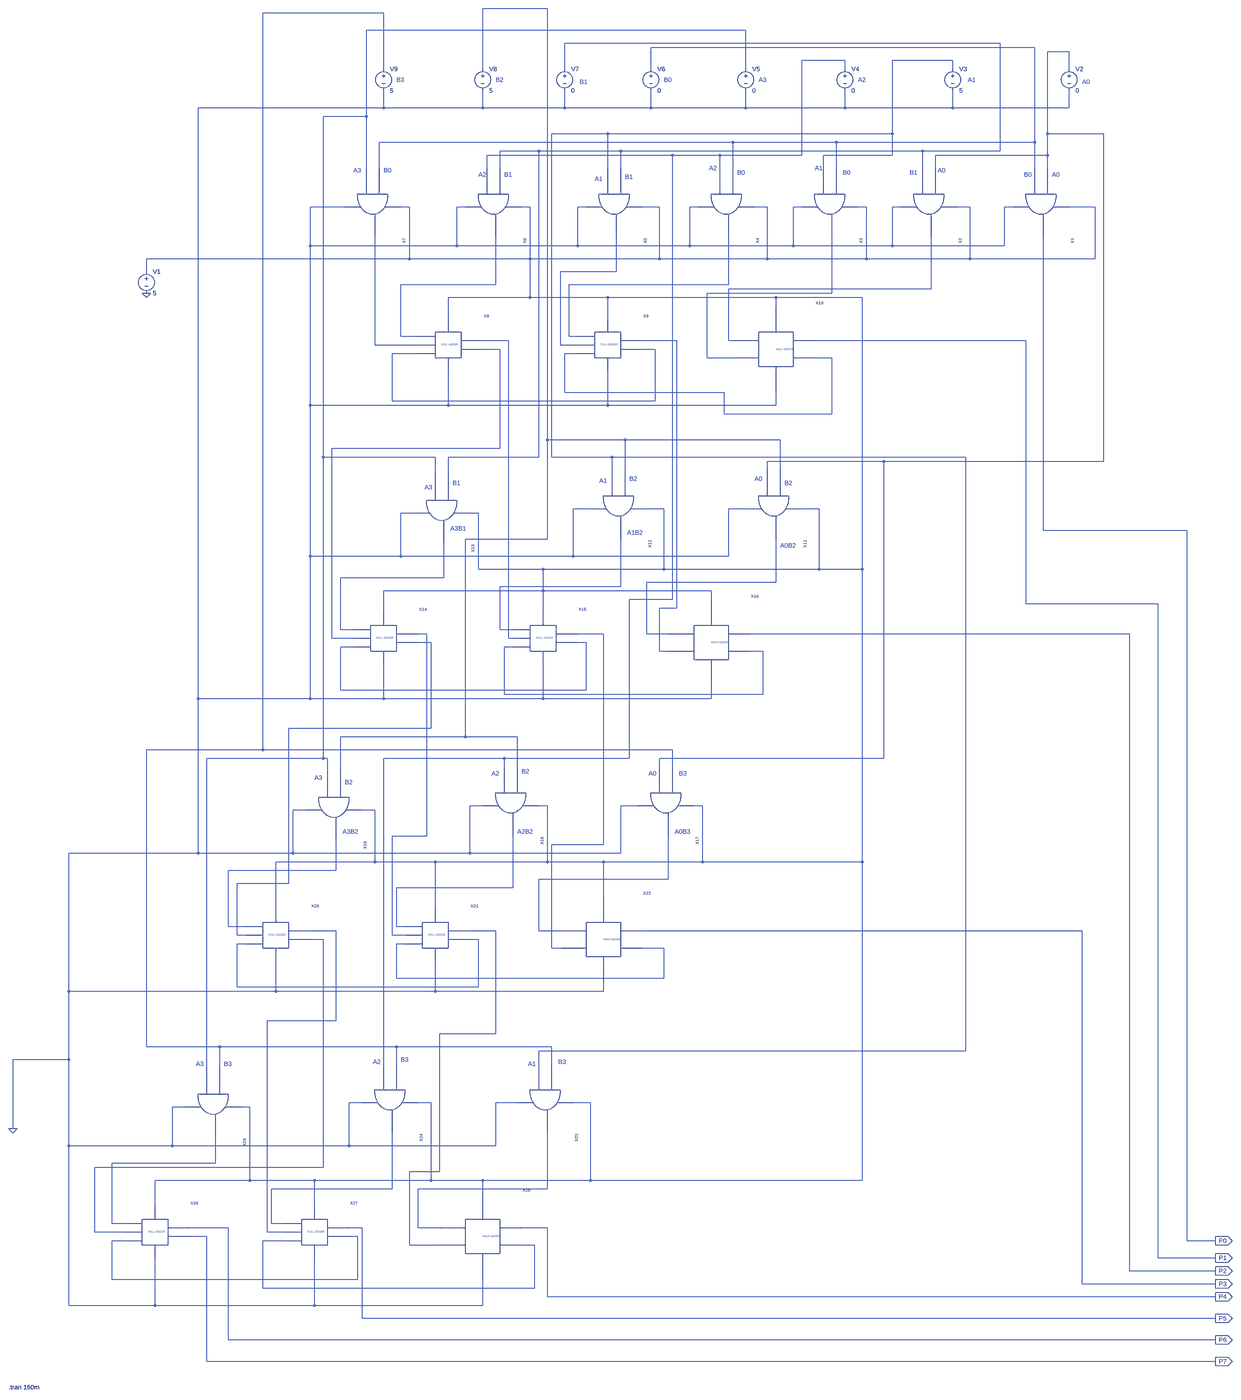
[diagram p0: schematic 4bitmultiplier.asc, whole sheet]
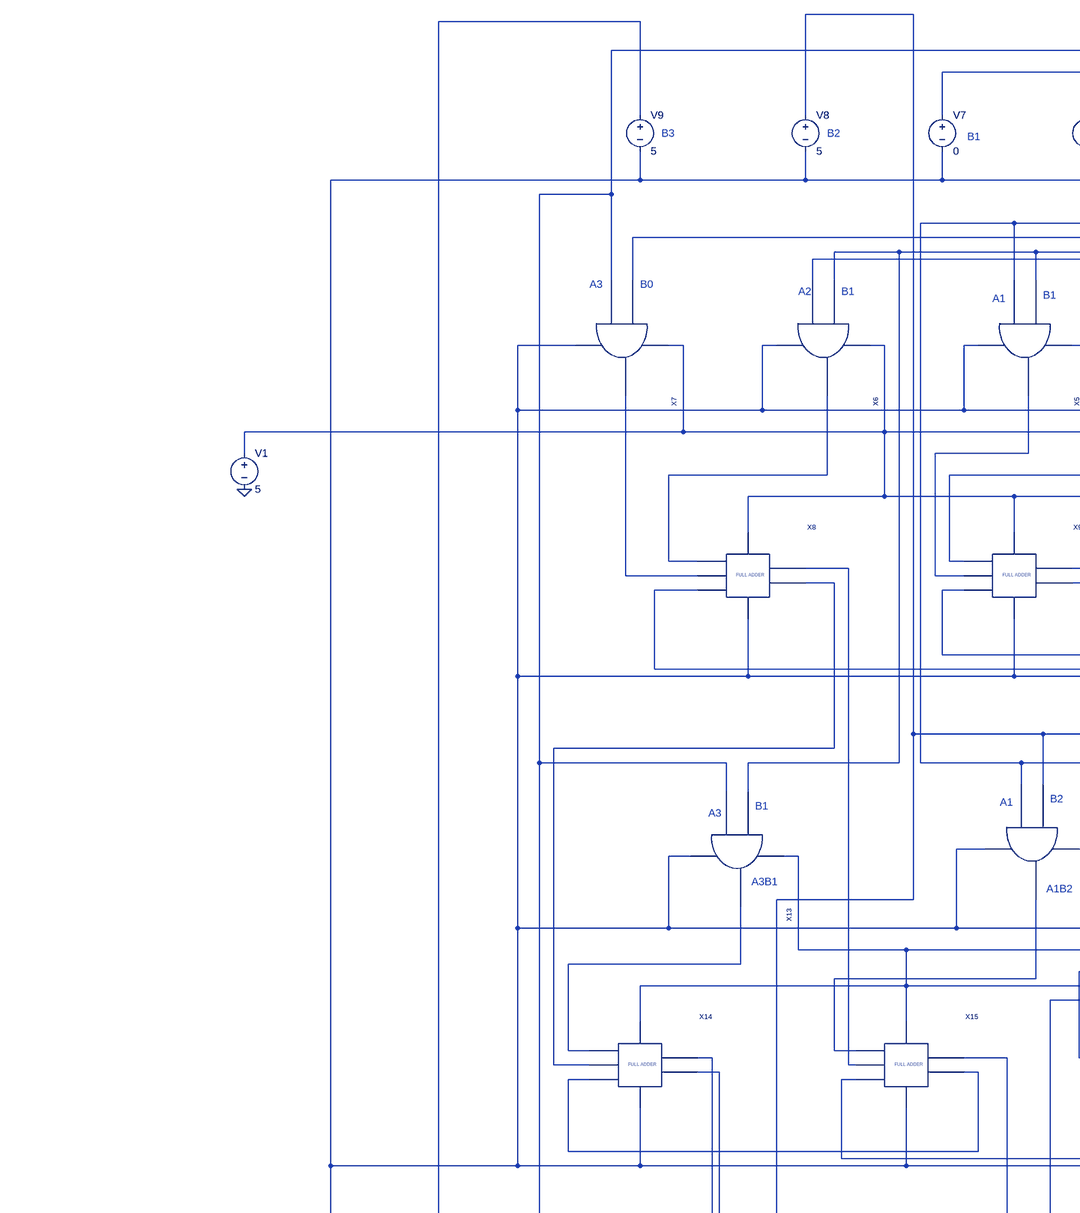
[diagram p1: schematic 4bitmultiplier.asc, part, row 1 of 2, column 1 of 2]
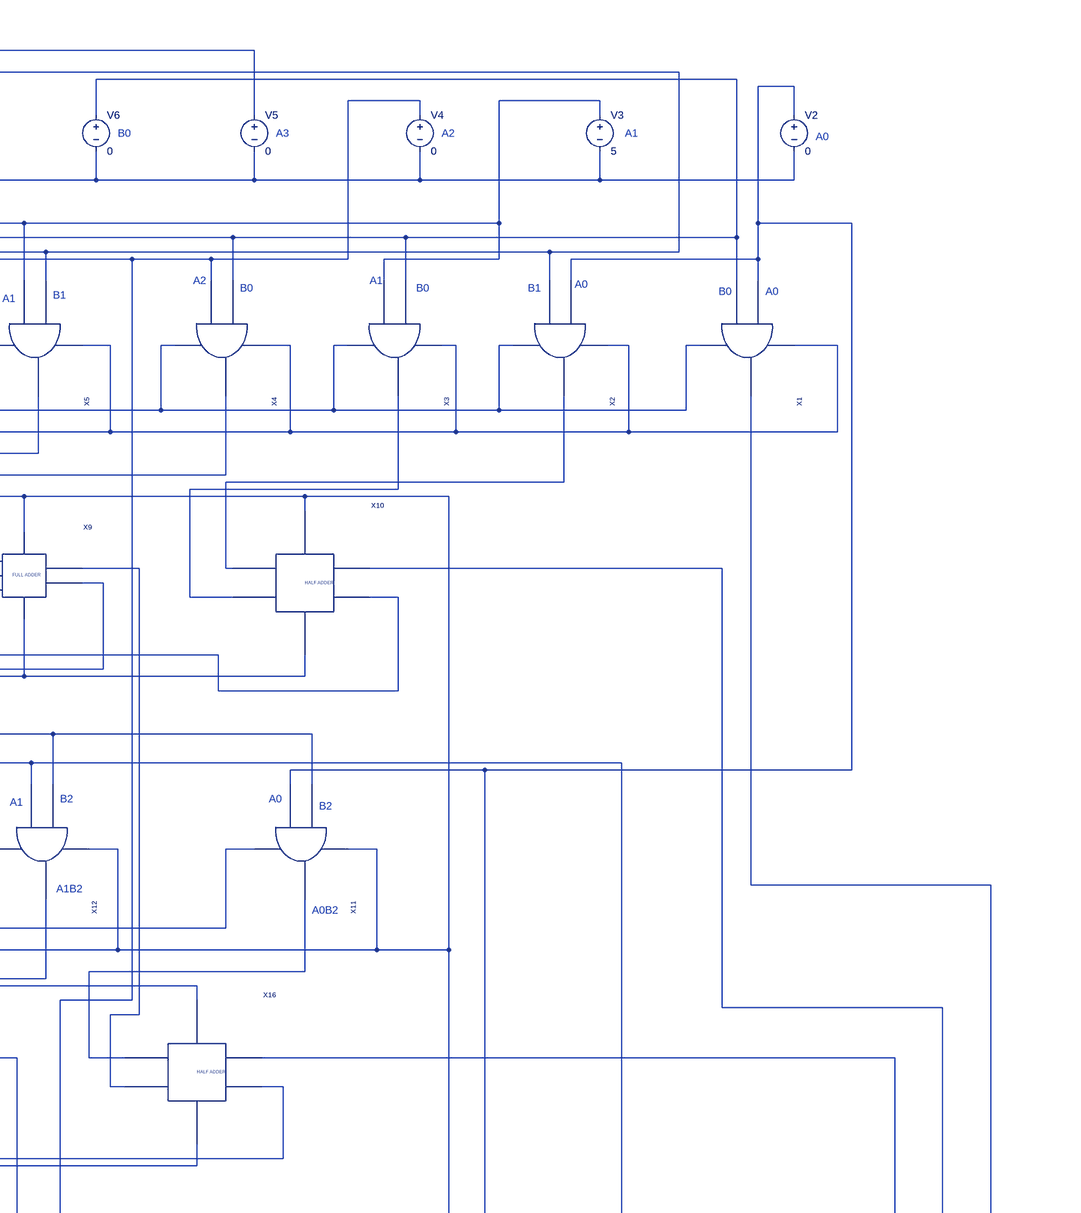
[diagram p2: schematic 4bitmultiplier.asc, part, row 1 of 2, column 2 of 2]
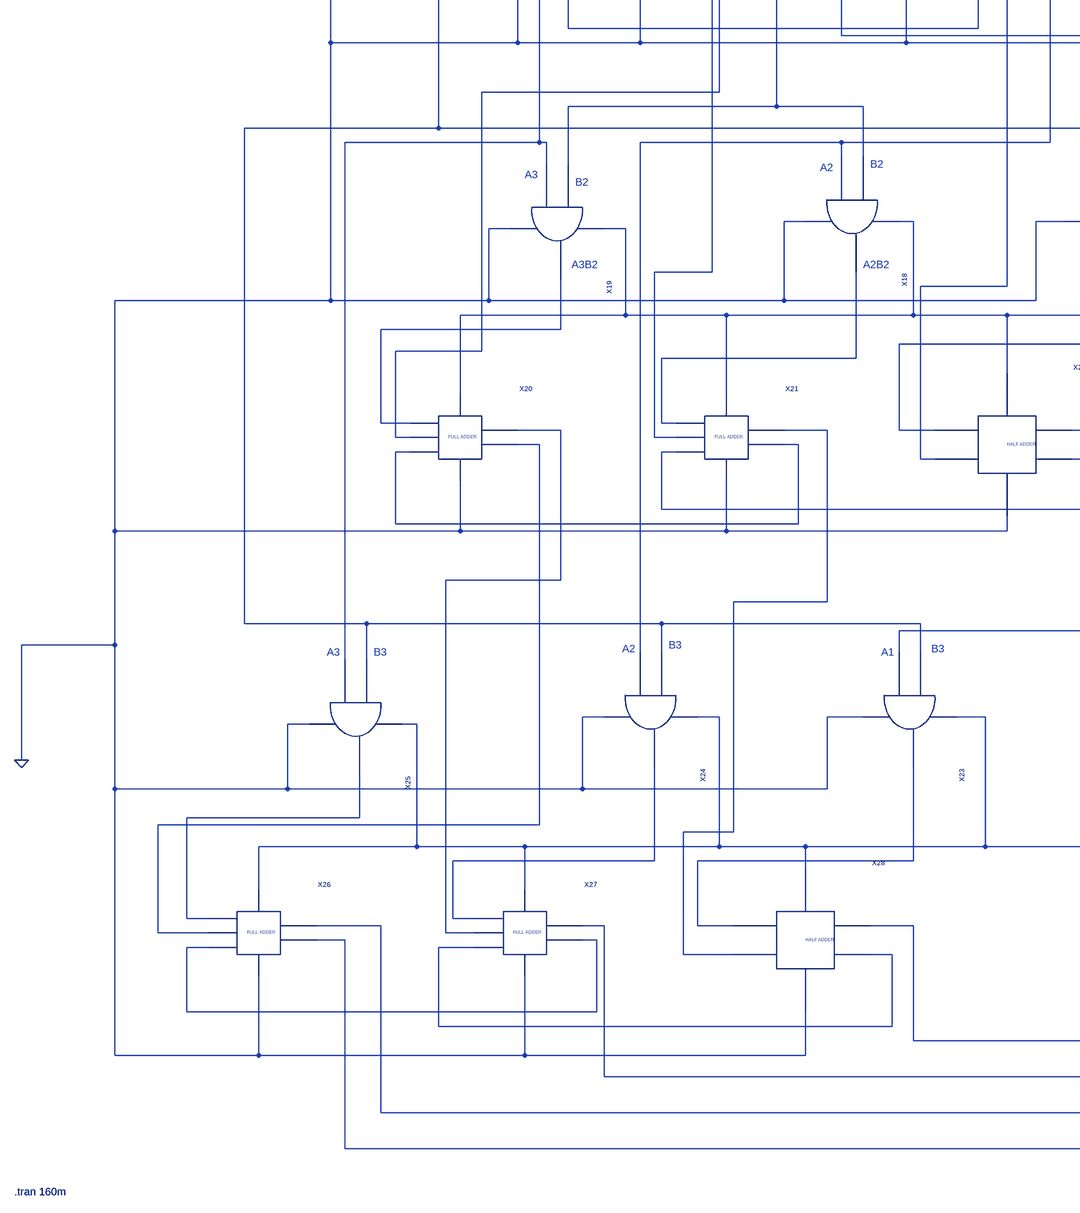
[diagram p3: schematic 4bitmultiplier.asc, part, row 2 of 2, column 1 of 2]
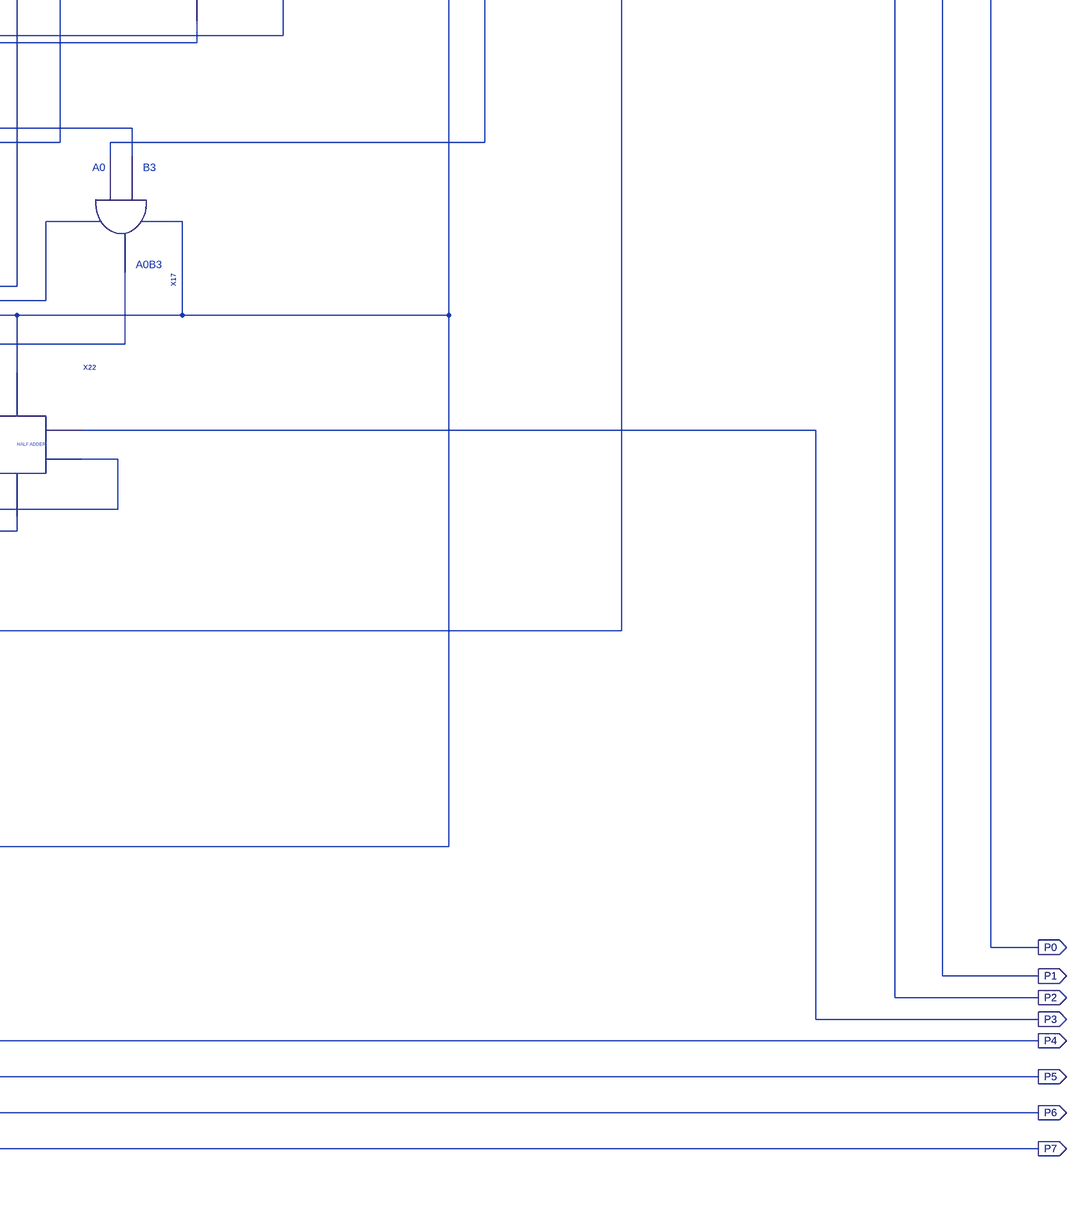
[diagram p4: schematic 4bitmultiplier.asc, part, row 2 of 2, column 2 of 2]
4bitmultiplier.asc, the LTspice schematic file:
Version 4
SHEET 1 1992 4504
WIRE -1168 -880 -1408 -880
WIRE -1776 -864 -2224 -864
WIRE -432 -800 -1840 -800
WIRE 512 -752 -1104 -752
WIRE 640 -736 -784 -736
WIRE 768 -720 688 -720
WIRE -64 -688 -224 -688
WIRE 336 -688 112 -688
WIRE -1776 -656 -1776 -864
WIRE -1408 -656 -1408 -880
WIRE -1104 -656 -1104 -752
WIRE -784 -656 -784 -736
WIRE -432 -656 -432 -800
WIRE -64 -656 -64 -688
WIRE 336 -656 336 -688
WIRE 768 -656 768 -720
WIRE -1776 -512 -1776 -576
WIRE -1776 -512 -2464 -512
WIRE -1408 -512 -1408 -576
WIRE -1408 -512 -1776 -512
WIRE -1104 -512 -1104 -576
WIRE -1104 -512 -1408 -512
WIRE -784 -512 -784 -576
WIRE -784 -512 -1104 -512
WIRE -432 -512 -432 -576
WIRE -432 -512 -784 -512
WIRE -64 -512 -64 -576
WIRE -64 -512 -432 -512
WIRE 336 -512 336 -576
WIRE 336 -512 -64 -512
WIRE 768 -512 768 -576
WIRE 768 -512 336 -512
WIRE -1840 -480 -1840 -800
WIRE -1840 -480 -2000 -480
WIRE -944 -416 -1152 -416
WIRE 112 -416 112 -688
WIRE 112 -416 -944 -416
WIRE 688 -416 688 -720
WIRE 896 -416 688 -416
WIRE -480 -384 -1792 -384
WIRE -96 -384 -480 -384
WIRE 640 -384 640 -736
WIRE 640 -384 -96 -384
WIRE -1200 -352 -1344 -352
WIRE -896 -352 -1200 -352
WIRE 224 -352 -896 -352
WIRE 512 -352 512 -752
WIRE 512 -352 224 -352
WIRE -704 -336 -1392 -336
WIRE -528 -336 -704 -336
WIRE -224 -336 -224 -688
WIRE -224 -336 -528 -336
WIRE 112 -336 112 -416
WIRE 112 -336 -144 -336
WIRE 688 -336 688 -416
WIRE 688 -336 272 -336
WIRE -1840 -288 -1840 -480
WIRE -1792 -288 -1792 -384
WIRE -1392 -288 -1392 -336
WIRE -1344 -288 -1344 -352
WIRE -944 -288 -944 -416
WIRE -896 -288 -896 -352
WIRE -528 -288 -528 -336
WIRE -480 -288 -480 -384
WIRE -144 -288 -144 -336
WIRE -96 -288 -96 -384
WIRE 224 -288 224 -352
WIRE 272 -288 272 -336
WIRE 640 -288 640 -384
WIRE 688 -288 688 -336
WIRE -1920 -144 -2048 -144
WIRE -1680 -144 -1712 -144
WIRE -1472 -144 -1504 -144
WIRE -1232 -144 -1264 -144
WIRE -1024 -144 -1056 -144
WIRE -752 -144 -816 -144
WIRE -608 -144 -640 -144
WIRE -352 -144 -400 -144
WIRE -224 -144 -256 -144
WIRE 16 -144 -16 -144
WIRE 144 -144 112 -144
WIRE 400 -144 352 -144
WIRE 560 -144 528 -144
WIRE 864 -144 768 -144
WIRE -2048 0 -2048 -144
WIRE -1504 0 -1504 -144
WIRE -1504 0 -2048 0
WIRE -1056 0 -1056 -144
WIRE -1056 0 -1504 0
WIRE -640 0 -640 -144
WIRE -640 0 -1056 0
WIRE -256 0 -256 -144
WIRE -256 0 -640 0
WIRE 112 0 112 -144
WIRE 112 0 -256 0
WIRE 528 0 528 -144
WIRE 528 0 112 0
WIRE -1680 48 -1680 -144
WIRE -1680 48 -2656 48
WIRE -1232 48 -1232 -144
WIRE -1232 48 -1680 48
WIRE -752 48 -752 -144
WIRE -752 48 -1232 48
WIRE -352 48 -352 -144
WIRE -352 48 -752 48
WIRE 16 48 16 -144
WIRE 16 48 -352 48
WIRE 400 48 400 -144
WIRE 400 48 16 48
WIRE 864 48 864 -144
WIRE 864 48 400 48
WIRE -2656 96 -2656 48
WIRE -912 96 -912 -32
WIRE -912 96 -1120 96
WIRE -1360 144 -1360 -32
WIRE -1360 144 -1712 144
WIRE -496 144 -496 -32
WIRE -496 144 -1088 144
WIRE 256 160 256 -32
WIRE 256 160 -496 160
WIRE -112 176 -112 -32
WIRE -112 176 -576 176
WIRE -1232 192 -1232 48
WIRE -1232 192 -1536 192
WIRE -944 192 -1232 192
WIRE -320 192 -944 192
WIRE 0 192 -320 192
WIRE -320 224 -320 192
WIRE -1536 272 -1536 192
WIRE -944 272 -944 192
WIRE -1712 336 -1712 144
WIRE -1648 336 -1712 336
WIRE -1088 336 -1088 144
WIRE -1056 336 -1088 336
WIRE -1312 352 -1408 352
WIRE -688 352 -816 352
WIRE -496 352 -496 160
WIRE -480 352 -496 352
WIRE 608 352 -176 352
WIRE -1808 368 -1808 -32
WIRE -1648 368 -1808 368
WIRE -1120 368 -1120 96
WIRE -1056 368 -1120 368
WIRE -1344 384 -1408 384
WIRE -768 384 -816 384
WIRE -1648 400 -1744 400
WIRE -1056 400 -1104 400
WIRE -576 416 -576 176
WIRE -480 416 -576 416
WIRE -112 416 -176 416
WIRE -1104 544 -1104 400
WIRE -512 544 -1104 544
WIRE -1744 576 -1744 400
WIRE -768 576 -768 384
WIRE -768 576 -1744 576
WIRE -2048 592 -2048 0
WIRE -1536 592 -1536 464
WIRE -1536 592 -2048 592
WIRE -944 592 -944 464
WIRE -944 592 -1536 592
WIRE -320 592 -320 544
WIRE -320 592 -944 592
WIRE -512 624 -512 544
WIRE -112 624 -112 416
WIRE -112 624 -512 624
WIRE -1168 720 -1168 -880
WIRE -880 720 -1168 720
WIRE -304 720 -880 720
WIRE -1344 752 -1344 384
WIRE -1344 752 -1968 752
WIRE -2000 784 -2000 -480
WIRE -1584 784 -2000 784
WIRE -1200 784 -1200 -352
WIRE -1200 784 -1536 784
WIRE -1152 784 -1152 -416
WIRE -928 784 -1152 784
WIRE 384 784 -928 784
WIRE 80 800 -352 800
WIRE 896 800 896 -416
WIRE 896 800 80 800
WIRE -928 832 -928 784
WIRE -880 832 -880 720
WIRE -352 832 -352 800
WIRE -304 832 -304 720
WIRE -1584 848 -1584 784
WIRE -1536 848 -1536 784
WIRE -1008 976 -1072 976
WIRE -736 976 -800 976
WIRE -432 976 -496 976
WIRE -160 976 -224 976
WIRE -1664 992 -1712 992
WIRE -1424 992 -1456 992
WIRE 672 1056 672 -32
WIRE 1632 1056 672 1056
WIRE -1168 1088 -1168 720
WIRE -1168 1088 -1472 1088
WIRE -2048 1152 -2048 592
WIRE -1712 1152 -1712 992
WIRE -1712 1152 -2048 1152
WIRE -1072 1152 -1072 976
WIRE -1072 1152 -1712 1152
WIRE -496 1152 -496 976
WIRE -496 1152 -1072 1152
WIRE -1424 1200 -1424 992
WIRE -1184 1200 -1424 1200
WIRE -736 1200 -736 976
WIRE -736 1200 -1184 1200
WIRE -160 1200 -160 976
WIRE -160 1200 -736 1200
WIRE 0 1200 0 192
WIRE 0 1200 -160 1200
WIRE -1552 1232 -1552 1104
WIRE -1552 1232 -1936 1232
WIRE -320 1248 -320 1088
WIRE -320 1248 -800 1248
WIRE -896 1264 -896 1088
WIRE -896 1264 -1344 1264
WIRE -1184 1280 -1184 1200
WIRE -1184 1280 -1776 1280
WIRE -560 1280 -1184 1280
WIRE -704 1312 -704 -336
WIRE -704 1312 -864 1312
WIRE -560 1312 -560 1280
WIRE 608 1328 608 352
WIRE 1264 1328 608 1328
WIRE -688 1344 -688 352
WIRE -688 1344 -752 1344
WIRE -1776 1360 -1776 1280
WIRE -1184 1360 -1184 1280
WIRE -1936 1424 -1936 1232
WIRE -1888 1424 -1936 1424
WIRE -1344 1424 -1344 1264
WIRE -1296 1424 -1344 1424
WIRE -1616 1440 -1648 1440
WIRE -960 1440 -1056 1440
WIRE -800 1440 -800 1248
WIRE -720 1440 -800 1440
WIRE 992 1440 -416 1440
WIRE -1968 1456 -1968 752
WIRE -1888 1456 -1968 1456
WIRE -1312 1456 -1312 352
WIRE -1296 1456 -1312 1456
WIRE -1600 1472 -1648 1472
WIRE -1024 1472 -1056 1472
WIRE -1888 1488 -1936 1488
WIRE -1296 1488 -1328 1488
WIRE -752 1504 -752 1344
WIRE -720 1504 -752 1504
WIRE -368 1504 -416 1504
WIRE -1936 1648 -1936 1488
WIRE -1024 1648 -1024 1472
WIRE -1024 1648 -1936 1648
WIRE -1328 1664 -1328 1488
WIRE -368 1664 -368 1504
WIRE -368 1664 -1328 1664
WIRE -2464 1680 -2464 -512
WIRE -2048 1680 -2048 1152
WIRE -2048 1680 -2464 1680
WIRE -1776 1680 -1776 1552
WIRE -1776 1680 -2048 1680
WIRE -1184 1680 -1184 1552
WIRE -1184 1680 -1776 1680
WIRE -560 1680 -560 1632
WIRE -560 1680 -1184 1680
WIRE -1600 1808 -1600 1472
WIRE -1600 1808 -2128 1808
WIRE -1472 1840 -1472 1088
WIRE -1472 1840 -1936 1840
WIRE -1280 1840 -1472 1840
WIRE -2224 1888 -2224 -864
WIRE -2224 1888 -2656 1888
WIRE -704 1888 -2224 1888
WIRE -2000 1920 -2000 784
WIRE -2000 1920 -2432 1920
WIRE -1984 1920 -2000 1920
WIRE -1328 1920 -1776 1920
WIRE -864 1920 -864 1312
WIRE -864 1920 -1328 1920
WIRE 80 1920 80 800
WIRE 80 1920 -752 1920
WIRE -1328 1952 -1328 1920
WIRE -1280 1952 -1280 1840
WIRE -752 1952 -752 1920
WIRE -704 1952 -704 1888
WIRE -1984 1968 -1984 1920
WIRE -1936 1968 -1936 1840
WIRE -1408 2096 -1456 2096
WIRE -1168 2096 -1200 2096
WIRE -832 2096 -896 2096
WIRE -592 2096 -624 2096
WIRE -2064 2112 -2112 2112
WIRE -1808 2112 -1856 2112
WIRE -1616 2208 -1616 1440
WIRE -1616 2208 -1744 2208
WIRE -960 2240 -960 1440
WIRE -960 2240 -1152 2240
WIRE -2464 2272 -2464 1680
WIRE -2464 2272 -2944 2272
WIRE -2112 2272 -2112 2112
WIRE -2112 2272 -2464 2272
WIRE -1456 2272 -1456 2096
WIRE -1456 2272 -2112 2272
WIRE -896 2272 -896 2096
WIRE -896 2272 -1456 2272
WIRE -1808 2304 -1808 2112
WIRE -1808 2304 -2176 2304
WIRE -1584 2304 -1808 2304
WIRE -1168 2304 -1168 2096
WIRE -1168 2304 -1584 2304
WIRE -960 2304 -1168 2304
WIRE -592 2304 -592 2096
WIRE -592 2304 -960 2304
WIRE 0 2304 0 1200
WIRE 0 2304 -592 2304
WIRE -1952 2336 -1952 2224
WIRE -1952 2336 -2352 2336
WIRE -720 2368 -720 2208
WIRE -720 2368 -1200 2368
WIRE -2128 2384 -2128 1808
WIRE -2128 2384 -2320 2384
WIRE -1296 2400 -1296 2208
WIRE -1296 2400 -1728 2400
WIRE -960 2432 -960 2304
WIRE -2176 2480 -2176 2304
WIRE -1584 2480 -1584 2304
WIRE -2352 2544 -2352 2336
WIRE -2288 2544 -2352 2544
WIRE -1728 2544 -1728 2400
WIRE -1696 2544 -1728 2544
WIRE -1952 2560 -2048 2560
WIRE -1360 2560 -1456 2560
WIRE -1200 2560 -1200 2368
WIRE -1120 2560 -1200 2560
WIRE 816 2560 -816 2560
WIRE -2320 2576 -2320 2384
WIRE -2288 2576 -2320 2576
WIRE -1744 2576 -1744 2208
WIRE -1696 2576 -1744 2576
WIRE -2000 2592 -2048 2592
WIRE -1424 2592 -1456 2592
WIRE -2288 2608 -2320 2608
WIRE -1696 2608 -1728 2608
WIRE -1152 2624 -1152 2240
WIRE -1120 2624 -1152 2624
WIRE -736 2624 -816 2624
WIRE -1728 2736 -1728 2608
WIRE -736 2736 -736 2624
WIRE -736 2736 -1728 2736
WIRE -2320 2768 -2320 2608
WIRE -1424 2768 -1424 2592
WIRE -1424 2768 -2320 2768
WIRE -2944 2784 -2944 2272
WIRE -2176 2784 -2176 2672
WIRE -2176 2784 -2944 2784
WIRE -1584 2784 -1584 2672
WIRE -1584 2784 -2176 2784
WIRE -960 2784 -960 2752
WIRE -960 2784 -1584 2784
WIRE -1952 2912 -1952 2560
WIRE -1952 2912 -2208 2912
WIRE -1360 2960 -1360 2560
WIRE -1360 2960 -1568 2960
WIRE -2656 3008 -2656 1888
WIRE -2384 3008 -2656 3008
WIRE -1728 3008 -2384 3008
WIRE -1152 3008 -1728 3008
WIRE 384 3024 384 784
WIRE 384 3024 -1200 3024
WIRE -2944 3056 -2944 2784
WIRE -2944 3056 -3568 3056
WIRE -1776 3072 -1776 1920
WIRE -1728 3072 -1728 3008
WIRE -1200 3072 -1200 3024
WIRE -1152 3072 -1152 3008
WIRE -2432 3088 -2432 1920
WIRE -2384 3088 -2384 3008
WIRE -1856 3216 -1904 3216
WIRE -1600 3216 -1648 3216
WIRE -1280 3216 -1360 3216
WIRE -1008 3216 -1072 3216
WIRE -2512 3232 -2560 3232
WIRE -2272 3232 -2304 3232
WIRE -3568 3312 -3568 3056
WIRE -2944 3376 -2944 3056
WIRE -2560 3376 -2560 3232
WIRE -2560 3376 -2944 3376
WIRE -1904 3376 -1904 3216
WIRE -1904 3376 -2560 3376
WIRE -1360 3376 -1360 3216
WIRE -1360 3376 -1904 3376
WIRE -2400 3440 -2400 3344
WIRE -2400 3440 -2784 3440
WIRE -2000 3456 -2000 2592
WIRE -2000 3456 -2848 3456
WIRE -1568 3472 -1568 2960
WIRE -1568 3472 -1680 3472
WIRE -2272 3504 -2272 3232
WIRE -2272 3504 -2624 3504
WIRE -2032 3504 -2272 3504
WIRE -1600 3504 -1600 3216
WIRE -1600 3504 -2032 3504
WIRE -1408 3504 -1600 3504
WIRE -1008 3504 -1008 3216
WIRE -1008 3504 -1408 3504
WIRE 0 3504 0 2304
WIRE 0 3504 -1008 3504
WIRE -1744 3536 -1744 3328
WIRE -1744 3536 -2192 3536
WIRE -1168 3536 -1168 3328
WIRE -1168 3536 -1648 3536
WIRE -1408 3552 -1408 3504
WIRE -2624 3600 -2624 3504
WIRE -2032 3600 -2032 3504
WIRE -2784 3664 -2784 3440
WIRE -2736 3664 -2784 3664
WIRE -2192 3664 -2192 3536
WIRE -2144 3664 -2192 3664
WIRE -2352 3680 -2496 3680
WIRE -1856 3680 -1904 3680
WIRE -1648 3680 -1648 3536
WIRE -1568 3680 -1648 3680
WIRE -1168 3680 -1264 3680
WIRE -2848 3696 -2848 3456
WIRE -2736 3696 -2848 3696
WIRE -2208 3696 -2208 2912
WIRE -2144 3696 -2208 3696
WIRE -2432 3712 -2496 3712
WIRE -1872 3712 -1904 3712
WIRE -2736 3728 -2784 3728
WIRE -2144 3728 -2224 3728
WIRE 1632 3728 1632 1056
WIRE 1904 3728 1632 3728
WIRE -1680 3744 -1680 3472
WIRE -1568 3744 -1680 3744
WIRE -1216 3744 -1264 3744
WIRE 1264 3792 1264 1328
WIRE 1904 3792 1264 3792
WIRE 992 3840 992 1440
WIRE 1904 3840 992 3840
WIRE -2784 3872 -2784 3728
WIRE -1872 3872 -1872 3712
WIRE -1872 3872 -2784 3872
WIRE 816 3888 816 2560
WIRE 1904 3888 816 3888
WIRE -2224 3904 -2224 3728
WIRE -1216 3904 -1216 3744
WIRE -1216 3904 -2224 3904
WIRE -1168 3936 -1168 3680
WIRE 1904 3936 -1168 3936
WIRE -2944 3968 -2944 3376
WIRE -2624 3968 -2624 3792
WIRE -2624 3968 -2944 3968
WIRE -2032 3968 -2032 3792
WIRE -2032 3968 -2624 3968
WIRE -1408 3968 -1408 3872
WIRE -1408 3968 -2032 3968
WIRE -1856 4016 -1856 3680
WIRE 1904 4016 -1856 4016
WIRE -2352 4096 -2352 3680
WIRE 1904 4096 -2352 4096
WIRE -2432 4176 -2432 3712
WIRE 1904 4176 -2432 4176
FLAG -3568 3312 0
FLAG -2656 176 0
FLAG 1904 3728 P0
IOPIN 1904 3728 Out
FLAG 1904 3792 P1
IOPIN 1904 3792 Out
FLAG 1904 3840 P2
IOPIN 1904 3840 Out
FLAG 1904 3888 P3
IOPIN 1904 3888 Out
FLAG 1904 3936 P4
IOPIN 1904 3936 Out
FLAG 1904 4016 P5
IOPIN 1904 4016 Out
FLAG 1904 4096 P6
IOPIN 1904 4096 Out
FLAG 1904 4176 P7
IOPIN 1904 4176 Out
SYMBOL andgateimply 672 -256 R90
SYMATTR InstName X1
SYMBOL andgateimply 256 -256 R90
SYMATTR InstName X2
SYMBOL andgateimply -112 -256 R90
SYMATTR InstName X3
SYMBOL andgateimply -496 -256 R90
SYMATTR InstName X4
SYMBOL andgateimply -912 -256 R90
SYMATTR InstName X5
SYMBOL andgateimply -1360 -256 R90
SYMATTR InstName X6
SYMBOL andgateimply -1808 -256 R90
SYMATTR InstName X7
SYMBOL fulladderimply -1536 368 R0
SYMATTR InstName X8
SYMBOL fulladderimply -944 368 R0
SYMATTR InstName X9
SYMBOL halfadderimply -336 384 R0
SYMATTR InstName X10
SYMBOL andgateimply -320 864 R90
SYMATTR InstName X11
SYMBOL andgateimply -896 864 R90
SYMATTR InstName X12
SYMBOL andgateimply -1552 880 R90
SYMATTR InstName X13
SYMBOL fulladderimply -1776 1456 R0
SYMATTR InstName X14
SYMBOL fulladderimply -1184 1456 R0
SYMATTR InstName X15
SYMBOL halfadderimply -576 1472 R0
SYMATTR InstName X16
SYMBOL andgateimply -720 1984 R90
SYMATTR InstName X17
SYMBOL andgateimply -1296 1984 R90
SYMATTR InstName X18
SYMBOL andgateimply -1952 2000 R90
SYMATTR InstName X19
SYMBOL fulladderimply -2176 2576 R0
SYMATTR InstName X20
SYMBOL fulladderimply -1584 2576 R0
SYMATTR InstName X21
SYMBOL halfadderimply -976 2592 R0
SYMATTR InstName X22
SYMBOL andgateimply -1168 3104 R90
SYMATTR InstName X23
SYMBOL andgateimply -1744 3104 R90
SYMATTR InstName X24
SYMBOL andgateimply -2400 3120 R90
SYMATTR InstName X25
SYMBOL fulladderimply -2624 3696 R0
SYMATTR InstName X26
SYMBOL fulladderimply -2032 3696 R0
SYMATTR InstName X27
SYMBOL halfadderimply -1424 3712 R0
SYMATTR InstName X28
SYMBOL voltage -2656 80 R0
WINDOW 123 0 0 Left 0
WINDOW 39 0 0 Left 0
SYMATTR InstName V1
SYMATTR Value 5
SYMBOL voltage 768 -672 R0
WINDOW 123 0 0 Left 0
WINDOW 39 0 0 Left 0
SYMATTR InstName V2
SYMATTR Value 0
SYMBOL voltage 336 -672 R0
WINDOW 123 0 0 Left 0
WINDOW 39 0 0 Left 0
SYMATTR InstName V3
SYMATTR Value 5
SYMBOL voltage -64 -672 R0
WINDOW 123 0 0 Left 0
WINDOW 39 0 0 Left 0
SYMATTR InstName V4
SYMATTR Value 0
SYMBOL voltage -432 -672 R0
WINDOW 123 0 0 Left 0
WINDOW 39 0 0 Left 0
SYMATTR InstName V5
SYMATTR Value 0
SYMBOL voltage -784 -672 R0
WINDOW 123 0 0 Left 0
WINDOW 39 0 0 Left 0
SYMATTR InstName V6
SYMATTR Value 0
SYMBOL voltage -1104 -672 R0
WINDOW 123 0 0 Left 0
WINDOW 39 0 0 Left 0
SYMATTR InstName V7
SYMATTR Value 0
SYMBOL voltage -1408 -672 R0
WINDOW 123 0 0 Left 0
WINDOW 39 0 0 Left 0
SYMATTR InstName V8
SYMATTR Value 5
SYMBOL voltage -1776 -672 R0
WINDOW 123 0 0 Left 0
WINDOW 39 0 0 Left 0
SYMATTR InstName V9
SYMATTR Value 5
TEXT 816 -608 Left 2 ;A0
TEXT 392 -616 Left 2 ;A1
TEXT -16 -616 Left 2 ;A2
TEXT -384 -616 Left 2 ;A3
TEXT -736 -616 Left 2 ;B0
TEXT -1048 -608 Left 2 ;B1
TEXT -1360 -616 Left 2 ;B2
TEXT -1728 -616 Left 2 ;B3
TEXT 704 -264 Left 2 ;A0
TEXT 600 -264 Left 2 ;B0
TEXT 280 -280 Left 2 ;A0
TEXT 176 -272 Left 2 ;B1
TEXT -72 -272 Left 2 ;B0
TEXT -176 -288 Left 2 ;A1
TEXT -568 -288 Left 2 ;A2
TEXT -464 -272 Left 2 ;B0
TEXT -1888 -280 Left 2 ;A3
TEXT -1776 -280 Left 2 ;B0
TEXT -1424 -264 Left 2 ;A2
TEXT -1328 -264 Left 2 ;B1
TEXT -992 -248 Left 2 ;A1
TEXT -880 -256 Left 2 ;B1
TEXT -304 1112 Left 2 ;A0B2
TEXT -872 1064 Left 2 ;A1B2
TEXT -1528 1048 Left 2 ;A3B1
TEXT -1624 896 Left 2 ;A3
TEXT -1520 880 Left 2 ;B1
TEXT -976 872 Left 2 ;A1
TEXT -864 864 Left 2 ;B2
TEXT -288 880 Left 2 ;B2
TEXT -400 864 Left 2 ;A0
TEXT -792 1976 Left 2 ;A0
TEXT -1376 1976 Left 2 ;A2
TEXT -2032 1992 Left 2 ;A3
TEXT -1920 2008 Left 2 ;B2
TEXT -1264 1968 Left 2 ;B2
TEXT -680 1976 Left 2 ;B3
TEXT -1928 2192 Left 2 ;A3B2
TEXT -1280 2192 Left 2 ;A2B2
TEXT -696 2192 Left 2 ;A0B3
TEXT -2368 3072 Left 2 ;B3
TEXT -1712 3056 Left 2 ;B3
TEXT -1128 3064 Left 2 ;B3
TEXT -1240 3072 Left 2 ;A1
TEXT -1816 3064 Left 2 ;A2
TEXT -2472 3072 Left 2 ;A3
TEXT -3584 4272 Left 2 !.tran 160m

The netlist it stands for:
* 4bitmultiplier.asc
XX1 N009 0 N006 N005 P0 andgateimply  ; pins VDD VSS A B OUT
XX2 N009 0 N006 N004 N013 andgateimply  ; pins VDD VSS A B OUT
XX3 N009 0 N005 N008 N014 andgateimply  ; pins VDD VSS A B OUT
XX4 N009 0 N005 N007 N012 andgateimply  ; pins VDD VSS A B OUT
XX5 N009 0 N004 N008 N010 andgateimply  ; pins VDD VSS A B OUT
XX6 N009 0 N004 N007 N011 andgateimply  ; pins VDD VSS A B OUT
XX7 N009 0 N005 N003 N017 andgateimply  ; pins VDD VSS A B OUT
XX8 N011 N017 N019 N009 0 N018 N015 fulladderimply  ; pins A B C VDD VSS CARRY SUM
XX9 N012 N010 N020 N009 0 N019 N016 fulladderimply  ; pins A B C VDD VSS CARRY SUM
XX10 N013 N014 N009 0 P1 N020 halfadderimply  ; pins A B VDD VSS SUM COUT
XX11 N009 0 N001 N006 N022 andgateimply  ; pins VDD VSS A B OUT
XX12 N009 0 N001 N008 N023 andgateimply  ; pins VDD VSS A B OUT
XX13 N009 0 N004 N003 N021 andgateimply  ; pins VDD VSS A B OUT
XX14 N021 N018 N027 N009 0 N026 N024 fulladderimply  ; pins A B C VDD VSS CARRY SUM
XX15 N023 N015 N028 N009 0 N027 N025 fulladderimply  ; pins A B C VDD VSS CARRY SUM
XX16 N022 N016 N009 0 P2 N028 halfadderimply  ; pins A B VDD VSS SUM COUT
XX17 N009 0 N002 N006 N030 andgateimply  ; pins VDD VSS A B OUT
XX18 N009 0 N001 N007 N031 andgateimply  ; pins VDD VSS A B OUT
XX19 N009 0 N001 N003 N029 andgateimply  ; pins VDD VSS A B OUT
XX20 N029 N026 N035 N009 0 N034 N032 fulladderimply  ; pins A B C VDD VSS CARRY SUM
XX21 N031 N024 N036 N009 0 N035 N033 fulladderimply  ; pins A B C VDD VSS CARRY SUM
XX22 N030 N025 N009 0 P3 N036 halfadderimply  ; pins A B VDD VSS SUM COUT
XX23 N009 0 N002 N008 N039 andgateimply  ; pins VDD VSS A B OUT
XX24 N009 0 N002 N007 N038 andgateimply  ; pins VDD VSS A B OUT
XX25 N009 0 N002 N003 N037 andgateimply  ; pins VDD VSS A B OUT
XX26 N037 N034 N040 N009 0 P7 P6 fulladderimply  ; pins A B C VDD VSS CARRY SUM
XX27 N038 N032 N041 N009 0 N040 P5 fulladderimply  ; pins A B C VDD VSS CARRY SUM
XX28 N039 N033 N009 0 P4 N041 halfadderimply  ; pins A B VDD VSS SUM COUT
V1 N009 0 5
V2 N006 0 0
V3 N008 0 5
V4 N007 0 0
V5 N003 0 0
V6 N005 0 0
V7 N004 0 0
V8 N001 0 5
V9 N002 0 5
* A0
* A1
* A2
* A3
* B0
* B1
* B2
* B3
* A0
* B0
* A0
* B1
* B0
* A1
* A2
* B0
* A3
* B0
* A2
* B1
* A1
* B1
* A0B2
* A1B2
* A3B1
* A3
* B1
* A1
* B2
* B2
* A0
* A0
* A2
* A3
* B2
* B2
* B3
* A3B2
* A2B2
* A0B3
* B3
* B3
* B3
* A1
* A2
* A3
.tran 160m
.backanno
.end